# EAGLE schematic Tester v0 (EAGLE 9.4.1)
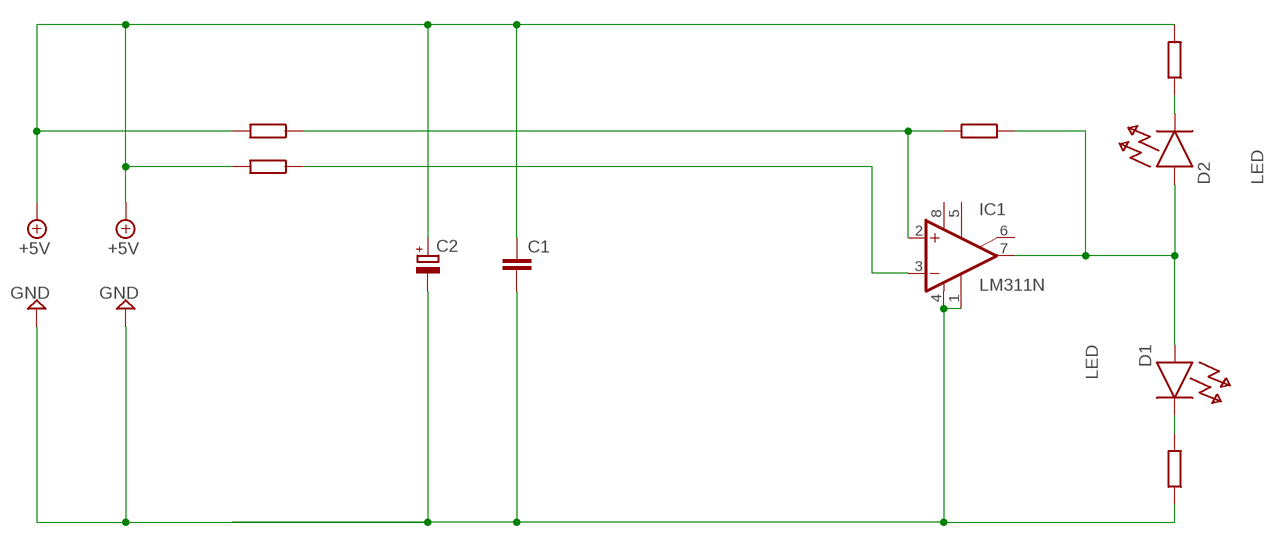
[diagram p0: schematic, sheet 1]

## Parts
C1  C2.5/4  [C2.5-4]
C2  CPOL-EUB45181D  [B45181D]
D1  LED  (no package)
D2  LED  (no package)
IC1  LM311N  [DIL08]

## Nets
+5V: C1.1 C2.+
GND: C1.2 C2.- IC1.1(GND) IC1.4(V-)
N$2: D1.A D2.A IC1.7(OUT)
N$3: D1.C
N$4: D2.C
N$6: IC1.2(+IN)
N$7: IC1.3(-IN)
Unconnected: IC1.5(ON) IC1.6(ON/STR)

## Power pins joined to a net without a drawn wire
V+: IC1.8(V+)

## Library data of the parts
C1 = capacitor-wima:C: CAPACITOR naming: grid - package width
C2 = rcl:CPOL-EU: POLARIZED CAPACITOR, European symbol; SPICEPREFIX: C
D1 D2 = ngspice-simulation:LED: Diode
IC1 = linear:LM311: COMPARATOR